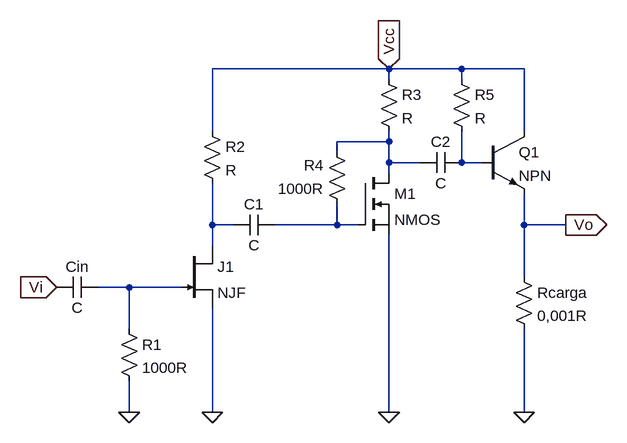
[diagram p0: schematic PROVA - P3_FET_2019_Questao_02_MultiEstagio.asc]
PROVA - P3_FET_2019_Questao_02_MultiEstagio.asc, the LTspice schematic file:
Version 4
SHEET 1 880 680
WIRE 416 -144 144 -144
WIRE 528 -144 416 -144
WIRE 624 -144 528 -144
WIRE 416 -128 416 -144
WIRE 528 -128 528 -144
WIRE 144 -48 144 -144
WIRE 624 -48 624 -144
WIRE 416 -32 416 -48
WIRE 416 -32 336 -32
WIRE 336 -16 336 -32
WIRE 416 0 416 -32
WIRE 464 0 416 0
WIRE 528 0 528 -48
WIRE 560 0 528 0
WIRE 416 16 416 0
WIRE 144 96 144 32
WIRE 176 96 144 96
WIRE 336 96 336 64
WIRE 336 96 240 96
WIRE 368 96 336 96
WIRE 624 96 624 48
WIRE 688 96 624 96
WIRE 144 128 144 96
WIRE 624 176 624 96
WIRE 16 192 -32 192
WIRE 96 192 16 192
WIRE 16 256 16 192
WIRE 16 384 16 336
WIRE 144 384 144 224
WIRE 416 384 416 112
WIRE 624 384 624 256
FLAG 16 384 0
FLAG 144 384 0
FLAG 416 384 0
FLAG 624 384 0
FLAG 416 -144 Vcc
IOPIN 416 -144 In
FLAG -96 192 Vi
IOPIN -96 192 In
FLAG 688 96 Vo
IOPIN 688 96 Out
SYMBOL njf 96 128 R0
SYMATTR InstName J1
SYMBOL res 0 240 R0
SYMATTR InstName R1
SYMATTR Value 1000R
SYMBOL res 128 -64 R0
SYMATTR InstName R2
SYMBOL cap 240 80 R90
WINDOW 0 0 32 VBottom 2
WINDOW 3 32 32 VTop 2
SYMATTR InstName C1
SYMBOL nmos 368 16 R0
SYMATTR InstName M1
SYMBOL res 400 -144 R0
SYMATTR InstName R3
SYMBOL res 352 80 R180
WINDOW 0 36 76 Left 2
WINDOW 3 36 40 Left 2
SYMATTR InstName R4
SYMATTR Value 1000R
SYMBOL npn 560 -48 R0
SYMATTR InstName Q1
SYMBOL cap 528 -16 R90
WINDOW 0 0 32 VBottom 2
WINDOW 3 32 32 VTop 2
SYMATTR InstName C2
SYMBOL res 608 160 R0
SYMATTR InstName Rcarga
SYMATTR Value 0,001R
SYMBOL cap -32 176 R90
WINDOW 0 0 32 VBottom 2
WINDOW 3 32 32 VTop 2
SYMATTR InstName Cin
SYMBOL res 512 -144 R0
SYMATTR InstName R5

The netlist it stands for:
* PROVA - P3_FET_2019_Questao_02_MultiEstagio.asc
J1 N003 N005 0 NJF
R1 N005 0 1000R
R2 Vcc N003 R
C1 N004 N003 C
M1 N001 N004 0 0 NMOS
R3 Vcc N001 R
R4 N004 N001 1000R
Q1 Vcc N002 Vo 0 NPN
C2 N002 N001 C
Rcarga Vo 0 0,001R
Cin N005 Vi C
R5 Vcc N002 R
.model NPN NPN
.model PNP PNP
.lib standard.bjt
.model NJF NJF
.model PJF PJF
.lib standard.jft
.model NMOS NMOS
.model PMOS PMOS
.lib standard.mos
.backanno
.end